# EAGLE design micromouse2018_v1 (EAGLE 8.7.1)
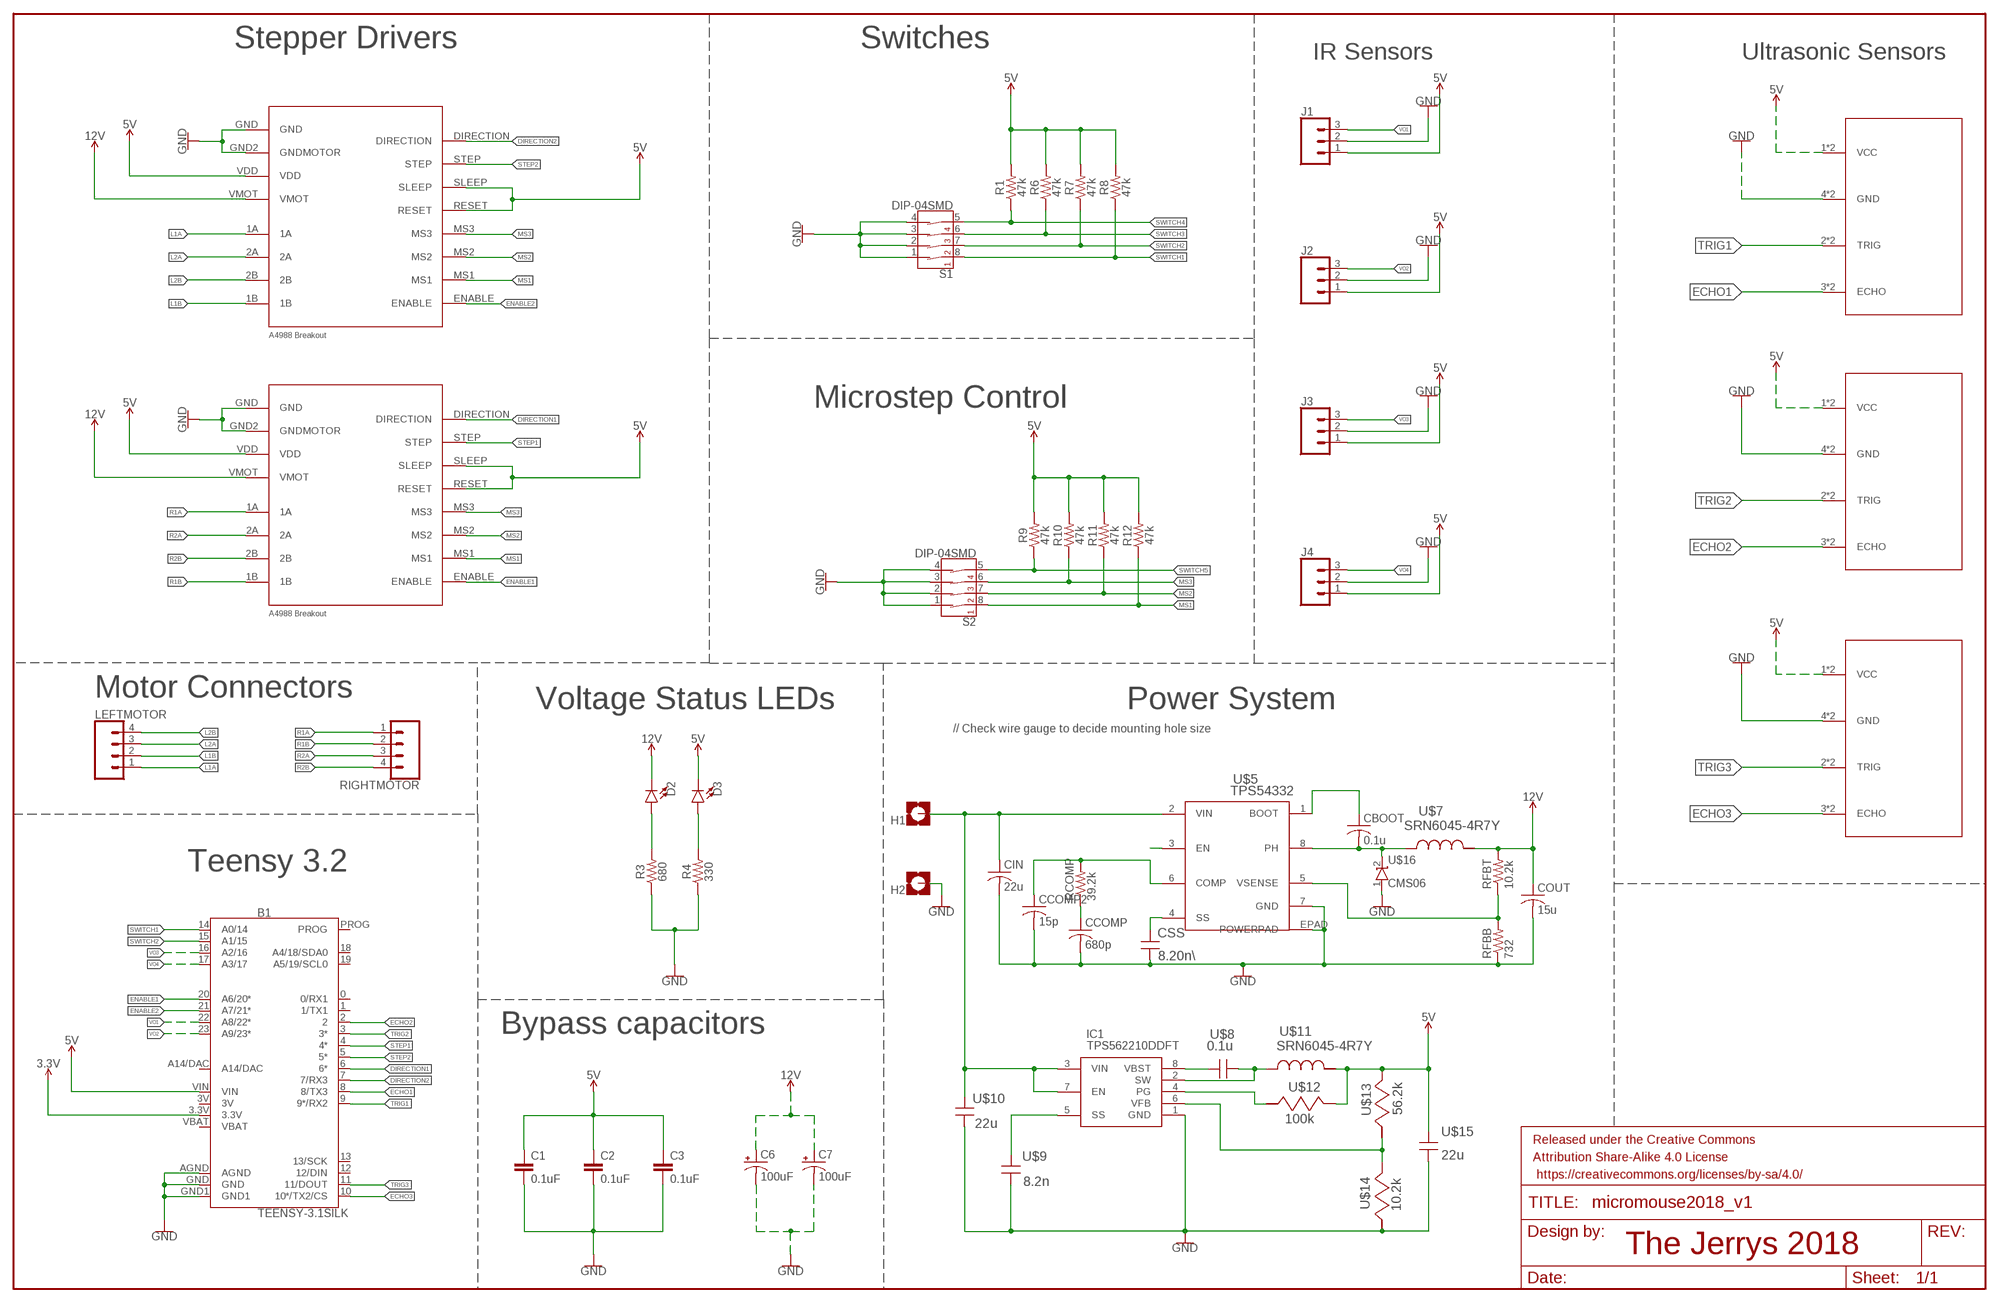
[diagram p0: schematic, sheet 1]

## Parts
B1  TEENSY-3.1SILK  [TEENSY-3.1]
C1  0.1uF  0.1UF-0603-25V-(+80/-20%)  [0603]
C2  0.1uF  0.1UF-0603-25V-(+80/-20%)  [0603]
C3  0.1uF  0.1UF-0603-25V-(+80/-20%)  [0603]
C6  100uF  100UF-POLAR-25V-20%(ELEC)  [PANASONIC_D]
C7  100uF  100UF-POLAR-25V-20%(ELEC)  [PANASONIC_D]
CBOOT  0.1u  C-USC0805  [C0805]
CCOMP  680p  C-USC0805  [C0805]
CCOMP2  15p  C-USC0805  [C0805]
CIN  22u  C-USC1210  [C1210]
COUT  15u  C-USC0805  [C0805]
CSS  8.20n\  12063A822JAT2A  [1206]
D2  LED0603  [LED-0603]
D3  LED0603  [LED-0603]
FRAME1  FRAME-LEDGER  [CREATIVE_COMMONS]
H1  MOUNT-PAD-SQUARE2.8  [2,8-PAD-SQUARE]
H2  MOUNT-PAD-SQUARE2.8  [2,8-PAD-SQUARE]
IC1  TPS562210DDFT  [SOT65P280X110-8N]
J1  CONN_03JST-PTH-VERT  [JST-3-PTH-VERT]
J2  CONN_03JST-PTH-VERT  [JST-3-PTH-VERT]
J3  CONN_03JST-PTH-VERT  [JST-3-PTH-VERT]
J4  CONN_03JST-PTH-VERT  [JST-3-PTH-VERT]
LEFTMOTOR  CONN_04LONGPADS  [1X04_LONGPADS]
R1  47k  47KOHM-0603-1/10W-1%  [0603]
R3  680  680OHM-0603-1/10W-5%  [0603]
R4  330  330OHM-0603-1/10W-1%  [0603]
R6  47k  47KOHM-0603-1/10W-1%  [0603]
R7  47k  47KOHM-0603-1/10W-1%  [0603]
R8  47k  47KOHM-0603-1/10W-1%  [0603]
R9  47k  47KOHM-0603-1/10W-1%  [0603]
R10  47k  47KOHM-0603-1/10W-1%  [0603]
R11  47k  47KOHM-0603-1/10W-1%  [0603]
R12  47k  47KOHM-0603-1/10W-1%  [0603]
RCOMP  39.2k  R-US_R0805  [R0805]
RFBB  732  R-US_R0805  [R0805]
RFBT  10.2k  R-US_R0805  [R0805]
RIGHTMOTOR  CONN_04LONGPADS  [1X04_LONGPADS]
S1  DIP-04SMD  [DIPSWITCH-04-SMD]
S2  DIP-04SMD  [DIPSWITCH-04-SMD]
U$1  A4988_BREAKOUT  [A4988_BREAKOUT]
U$2  A4988_BREAKOUT  [A4988_BREAKOUT]
U$3  ULTRASONIC  [1X04_SMD_VERTICAL_COMBO]
U$4  ULTRASONIC  [1X04_SMD_VERTICAL_COMBO]
U$5  TPS54332  [DDA8_2P13X3-M]
U$6  ULTRASONIC  [1X04_SMD_VERTICAL_COMBO]
U$7  SRN6045-4R7Y  [SRN6045]
U$8  0.1u  08053C104KAT2A  [0805]
U$9  8.2n  12063A822JAT2A  [1206]
U$10  22u  GRM32ER61E226KE15L  [1210]
U$11  SRN6045-4R7Y  [SRN6045]
U$12  100k  RR1220P-104-D  [0805]
U$13  56.2k  ERJ-6ENF5622V  [0805]
U$14  10.2k  ERJ-6ENF1022V  [0805]
U$15  22u  GRM31CR61A226KE19L  [1206_190]
U$16  CMS06  [SODFL4724X108N]

## Nets
3.3V: B1.3.3V
5V: B1.VIN C1.1 C2.1 C3.1 D3.C J1.1 J2.1 J3.1 J4.1 R1.2 R6.2 R7.2 R8.2 R9.2 R10.2 R11.2 R12.2 U$1.RESET U$1.SLEEP U$1.VDD U$2.RESET U$2.SLEEP U$2.VDD U$3.1(VCC) U$3.1-2(VCC) U$4.1(VCC) U$4.1-2(VCC) U$6.1(VCC) U$6.1-2(VCC) U$11.2 U$12.1 U$13.1 U$15.1
12V: C6.+ C7.+ COUT.1 D2.C RFBT.2 U$1.VMOT U$2.VMOT U$7.2
BOOT: IC1.2(SW) U$8.1 U$11.1
DIRECTION1: B1.6(6*) U$2.DIRECTION
DIRECTION2: B1.7(7/RX3) U$1.DIRECTION
ECHO1: B1.8(8/TX3) U$3.3(ECHO) U$3.3-2(ECHO)
ECHO2: B1.2 U$4.3(ECHO) U$4.3-2(ECHO)
ECHO3: B1.10(10*/TX2/CS) U$6.3(ECHO) U$6.3-2(ECHO)
ENABLE1: B1.20(A6/20*) U$2.ENABLE
ENABLE2: B1.21(A7/21*) U$1.ENABLE
GND: B1.AGND B1.GND B1.GND1 C1.2 C2.2 C3.2 C6.- C7.- CCOMP2.2 CCOMP.2 CIN.2 COUT.2 CSS.1 H2.B2,8(MOUNT) IC1.1(GND) J1.2 J2.2 J3.2 J4.2 R3.1 R4.1 RFBB.1 S1.1(1A) S1.2(2A) S1.3(3A) S1.4(4A) S2.1(1A) S2.2(2A) S2.3(3A) S2.4(4A) U$1.GND U$1.GND2(GNDMOTOR) U$2.GND U$2.GND2(GNDMOTOR) U$3.4(GND) U$3.4-2(GND) U$4.4(GND) U$4.4-2(GND) U$5.7(GND) U$5.EPAD(POWERPAD) U$6.4(GND) U$6.4-2(GND) U$9.2 U$10.2 U$14.2 U$15.2 U$16.1(A)
L1A: LEFTMOTOR.1 U$1.1A
L1B: LEFTMOTOR.2 U$1.1B
L2A: LEFTMOTOR.3 U$1.2A
L2B: LEFTMOTOR.4 U$1.2B
MS1: R12.1 S2.8(1B) U$1.MS1 U$2.MS1
MS2: R11.1 S2.7(2B) U$1.MS2 U$2.MS2
MS3: R10.1 S2.6(3B) U$1.MS3 U$2.MS3
N$1: D2.A R3.2
N$2: D3.A R4.2
N$5: CSS.2 U$5.4(SS)
N$6: IC1.8(VBST) U$8.2
N$8: U$5.3(EN)
N$9: RFBB.2 RFBT.1 U$5.5(VSENSE)
N$10: CBOOT.1 U$5.1(BOOT)
N$11: CCOMP2.1 RCOMP.2 U$5.6(COMP)
N$12: CCOMP.1 RCOMP.1
N$15: IC1.4(PG) U$12.2
N$16: IC1.6(VFB) U$13.2 U$14.1
N$18: IC1.5(SS) U$9.1
PH: CBOOT.2 U$5.8(PH) U$7.1 U$16.2(K)
R1A: RIGHTMOTOR.1 U$2.1A
R1B: RIGHTMOTOR.2 U$2.1B
R2A: RIGHTMOTOR.3 U$2.2A
R2B: RIGHTMOTOR.4 U$2.2B
STEP1: B1.4(4*) U$2.STEP
STEP2: B1.5(5*) U$1.STEP
SWITCH1: B1.14(A0/14) R8.1 S1.8(1B)
SWITCH2: B1.15(A1/15) R7.1 S1.7(2B)
SWITCH3: R6.1 S1.6(3B)
SWITCH4: R1.1 S1.5(4B)
SWITCH5: R9.1 S2.5(4B)
TRIG1: B1.9(9*/RX2) U$3.2(TRIG) U$3.2-2(TRIG)
TRIG2: B1.3(3*) U$4.2(TRIG) U$4.2-2(TRIG)
TRIG3: B1.11(11/DOUT) U$6.2(TRIG) U$6.2-2(TRIG)
VIN: CIN.1 H1.B2,8(MOUNT) IC1.3(VIN) IC1.7(EN) U$5.2(VIN) U$10.1
VO1: B1.22(A8/22*) J1.3
VO2: B1.23(A9/23*) J2.3
VO3: B1.16(A2/16) J3.3
VO4: B1.17(A3/17) J4.3
Unconnected: B1.0(0/RX1) B1.1(1/TX1) B1.12(12/DIN) B1.13(13/SCK) B1.18(A4/18/SDA0) B1.19(A5/19/SCL0) B1.A14/DAC B1.PROG

## Notes on the sheet
- Stepper Drivers | Switches
- IR Sensors | Ultrasonic Sensors
- Microstep Control
- Motor Connectors
- Voltage Status LEDs | Power System
- // Check wire gauge to decide mounting hole size
- Teensy 3.2
- Bypass capacitors
- The Jerrys 2018

## Power pins joined to a net without a drawn wire
3V: B1.3V
VBAT: B1.VBAT

## Library data of the parts
B1 = SparkFun-Boards:TEENSY-3.1: Teensy 3+ Footprint Mechanical footprint with connectors for Teensy Development Board with ARM Cortex. SparkFun Products: Teensy 3.2 <https://www.sparkfun.com/products/13736> Teensy LC <https://www.sparkfun.com/products/13305>; SF_ID: DEV-12646
C1-C3 = SparkFun-Capacitors:0.1UF: 0.1µF ceramic capacitors A capacitor is a passive two-terminal electrical component used to store electrical energy temporarily in an electric field.; PROD_ID: CAP-00810
C6 C7 = SparkFun-Capacitors:100UF-POLAR: 100µF polarized capacitors A capacitor is a passive two-terminal electrical component used to store electrical energy temporarily in an electric field.; PROD_ID: CAP-12547
CBOOT CCOMP CCOMP2 COUT = resistor:C-US: CAPACITOR, American symbol
CIN = rcl:C-US: CAPACITOR, American symbol
CSS U$9 = AcceleratedDesigns_Lib:12063A822JAT2A; CAP: 8.2E8; DATASHEETURL: httpwww.avx.comdocsCatalogsccog.pdf; ESR: 0.0; IRMS: 0.0; MANUFACTURER_NAME: AVX; MANUFACTURER_PART_NUMBER: 12063A822JAT2A; VDC: 25.0; VENDOR: AVX
D2 D3 = SparkFun-LED:LED: LED (Generic) Standard schematic elements and footprints for 5mm, 3mm, 1206, and 0603 sized LEDs. Generic LEDs with no color specified.
FRAME1 = SparkFun-Aesthetics:FRAME-LEDGER: Schematic Frame - Ledger Standard 11x14 US Ledger frame
H1 H2 = holes:MOUNT-PAD-SQUARE: MOUNTING PAD, square
IC1 = TPS562210DDFT:TPS562210DDFT: Step-down DC-DC Conv 4.5-17V 2A TSOT23-8 Texas Instruments, TPS562210DDFT Step-Down Switching Regulator 2A Adjustable, 0.76 7 V, 8-Pin SOT-23 Source: Datasheet <http://www.ti.com/lit/ds/symlink/tps562210.pdf>; DESCRIPTION: Step-down DC-DC Conv 4.5-17V 2A TSOT23-8 Texas Instruments, TPS562210DDFT Step-Down Switching Regulator 2A Adjustable, 0.76 7 V, 8-Pin SOT-23; HEIGHT: 1.1mm; MANUFACTURER_NAME: Texas Instruments; MANUFACTURER_PART_NUMBER: TPS562210DDFT; RS_PART_NUMBER: 9009845; RS_PRICE/STOCK: http://uk.rs-online.com/web/p/products/9009845
J1-J4 = SparkFun-Connectors:CONN_03: Multi connection point. Often used as Generic Header-pin footprint for 0.1 inch spaced/style header connections On any of the 0.1 inch spaced packages, you can populate with these: Break Away Headers - Straight <https://www.sparkfun.com/products/116> (PRT-00116) Break Away Male Headers - Right Angle <https://www.sparkfun.com/products/553> (PRT-00553) Female Headers <https://www.sparkfun.com/products/115> (PRT-00115) Break Away Headers - Machine Pin <https://www.sparkfun.com/products/117> (PRT-00117) Break Away Female Headers - Swiss Machine Pin <https://www.sparkfun.com/products/743> (PRT-00743) Stackable Header - 3 Pin (Female, 0.1") <https://www.sparkfun.com/products/13875> (PRT-13875) For SCREWTERMINALS and SPRING TERMINALS visit here: Screw Terimnals on SparkFun.com <https://www.sparkfun.com/search/results?term=Screw+Terminals> (5mm/3.5mm/2.54mm spacing) This device is also useful as a general connection point to wire up your design to another part of your project. Our various solder wires solder well into these plated through hole pads. Hook-Up Wire - Assortment (Stranded, 22 AWG) <https://www.sparkfun.com/products/11375> (PRT-11375) Hook-Up Wire - Assortment (Solid Core, 22 AWG) <https://www.sparkfun.com/products/11367> (PRT-11367) View the entire wire category on our website here <https://www.sparkfun.com/categories/141> Special notes: Molex polarized connector foot print use with SKU : PRT-08232 with associated crimp pins and housings.; PROD_ID: CONN-13230
LEFTMOTOR RIGHTMOTOR = SparkFun-Connectors:CONN_04: Multi connection point. Often used as Generic Header-pin footprint for 0.1 inch spaced/style header connections On any of the 0.1 inch spaced packages, you can populate with these: Break Away Headers - Straight <https://www.sparkfun.com/products/116> (PRT-00116) Break Away Male Headers - Right Angle <https://www.sparkfun.com/products/553> (PRT-00553) Female Headers <https://www.sparkfun.com/products/115> (PRT-00115) Break Away Headers - Machine Pin <https://www.sparkfun.com/products/117> (PRT-00117) Break Away Female Headers - Swiss Machine Pin <https://www.sparkfun.com/products/743> (PRT-00743) For SCREWTERMINALS and SPRING TERMINALS visit here: Screw Terimnals on SparkFun.com <https://www.sparkfun.com/search/results?term=Screw+Terminals> (5mm/3.5mm/2.54mm spacing) This device is also useful as a general connection point to wire up your design to another part of your project. Our various solder wires solder well into these plated through hole pads. Hook-Up Wire - Assortment (Stranded, 22 AWG) <https://www.sparkfun.com/products/11375> (PRT-11375) Hook-Up Wire - Assortment (Solid Core, 22 AWG) <https://www.sparkfun.com/products/11367> (PRT-11367) View the entire wire category on our website here <https://www.sparkfun.com/categories/141> Special notes: Molex polarized connector foot print use with SKU : PRT-08231 with associated crimp pins and housings. 1MM SMD Version SKU: PRT-10208; PROD_ID: CONN-09696
R1 R6-R12 = SparkFun-Resistors:47KOHM: 47kΩ resistor A resistor is a passive two-terminal electrical component that implements electrical resistance as a circuit element. Resistors act to reduce current flow, and, at the same time, act to lower voltage levels within circuits. - Wikipedia; PROD_ID: RES-07871
R3 = SparkFun-Resistors:680OHM: 680Ω resistor A resistor is a passive two-terminal electrical component that implements electrical resistance as a circuit element. Resistors act to reduce current flow, and, at the same time, act to lower voltage levels within circuits. - Wikipedia; PROD_ID: RES-09333
R4 = SparkFun-Resistors:330OHM: 330Ω resistor A resistor is a passive two-terminal electrical component that implements electrical resistance as a circuit element. Resistors act to reduce current flow, and, at the same time, act to lower voltage levels within circuits. - Wikipedia; PROD_ID: RES-00818
RCOMP RFBB RFBT = resistor:R-US_: RESISTOR, American symbol
S1 S2 = SparkFun-Switches:DIP-04: 4-Position DIP Switch 4-circuit DIP (dual inline package) switch. Commonly used to physcially set a circuit's behavior. SparkFun Products Prototype Part; PROD_ID: SWCH-12418
U$1 U$2 = raParts:A4988_BREAKOUT
U$3 U$4 U$6 = raParts:ULTRASONIC
U$5 = TPS54332:TPS54332
U$7 U$11 = AcceleratedDesigns_Lib:SRN6045-4R7Y; DATASHEETURL: httpwww.bourns.comdataglobalpdfsSRN6045.pdf; DCR: 0.0376; IDC: 3.0; L: 4.7E6; MANUFACTURER_NAME: Bourns; MANUFACTURER_PART_NUMBER: SRN60454R7Y; VENDOR: Bourns
U$8 = AcceleratedDesigns_Lib:08053C104KAT2A; CAP: 1.0E7; ESR: 0.28; IRMS: 0.0; MANUFACTURER_NAME: AVX; MANUFACTURER_PART_NUMBER: 08053C104KAT2A; VDC: 25.0; VENDOR: AVX
U$10 = AcceleratedDesigns_Lib:GRM32ER61E226KE15L; CAP: 2.2E5; ESR: 0.0020; IRMS: 0.0; MANUFACTURER_NAME: MuRata; MANUFACTURER_PART_NUMBER: GRM32ER61E226KE15L; VDC: 25.0; VENDOR: MuRata
U$12 = AcceleratedDesigns_Lib:RR1220P-104-D; MANUFACTURER_NAME: Susumu Co Ltd; MANUFACTURER_PART_NUMBER: RR1220P104D; POWER: 0.1; RESISTANCE: 100000.0; TOLERANCE: 0.5; VENDOR: Susumu Co Ltd
U$13 = AcceleratedDesigns_Lib:ERJ-6ENF5622V; MANUFACTURER_NAME: Panasonic; MANUFACTURER_PART_NUMBER: ERJ6ENF5622V; POWER: 0.125; RESISTANCE: 56200.0; TOLERANCE: 1.0; VENDOR: Panasonic
U$14 = AcceleratedDesigns_Lib:ERJ-6ENF1022V; MANUFACTURER_NAME: Panasonic; MANUFACTURER_PART_NUMBER: ERJ6ENF1022V; POWER: 0.125; RESISTANCE: 10200.0; TOLERANCE: 1.0; VENDOR: Panasonic
U$15 = AcceleratedDesigns_Lib:GRM31CR61A226KE19L; CAP: 2.2E5; ESR: 0.0; IRMS: 0.0; MANUFACTURER_NAME: MuRata; MANUFACTURER_PART_NUMBER: GRM31CR61A226KE19L; VDC: 10.0; VENDOR: MuRata
U$16 = Scraps:CMS06

## Board
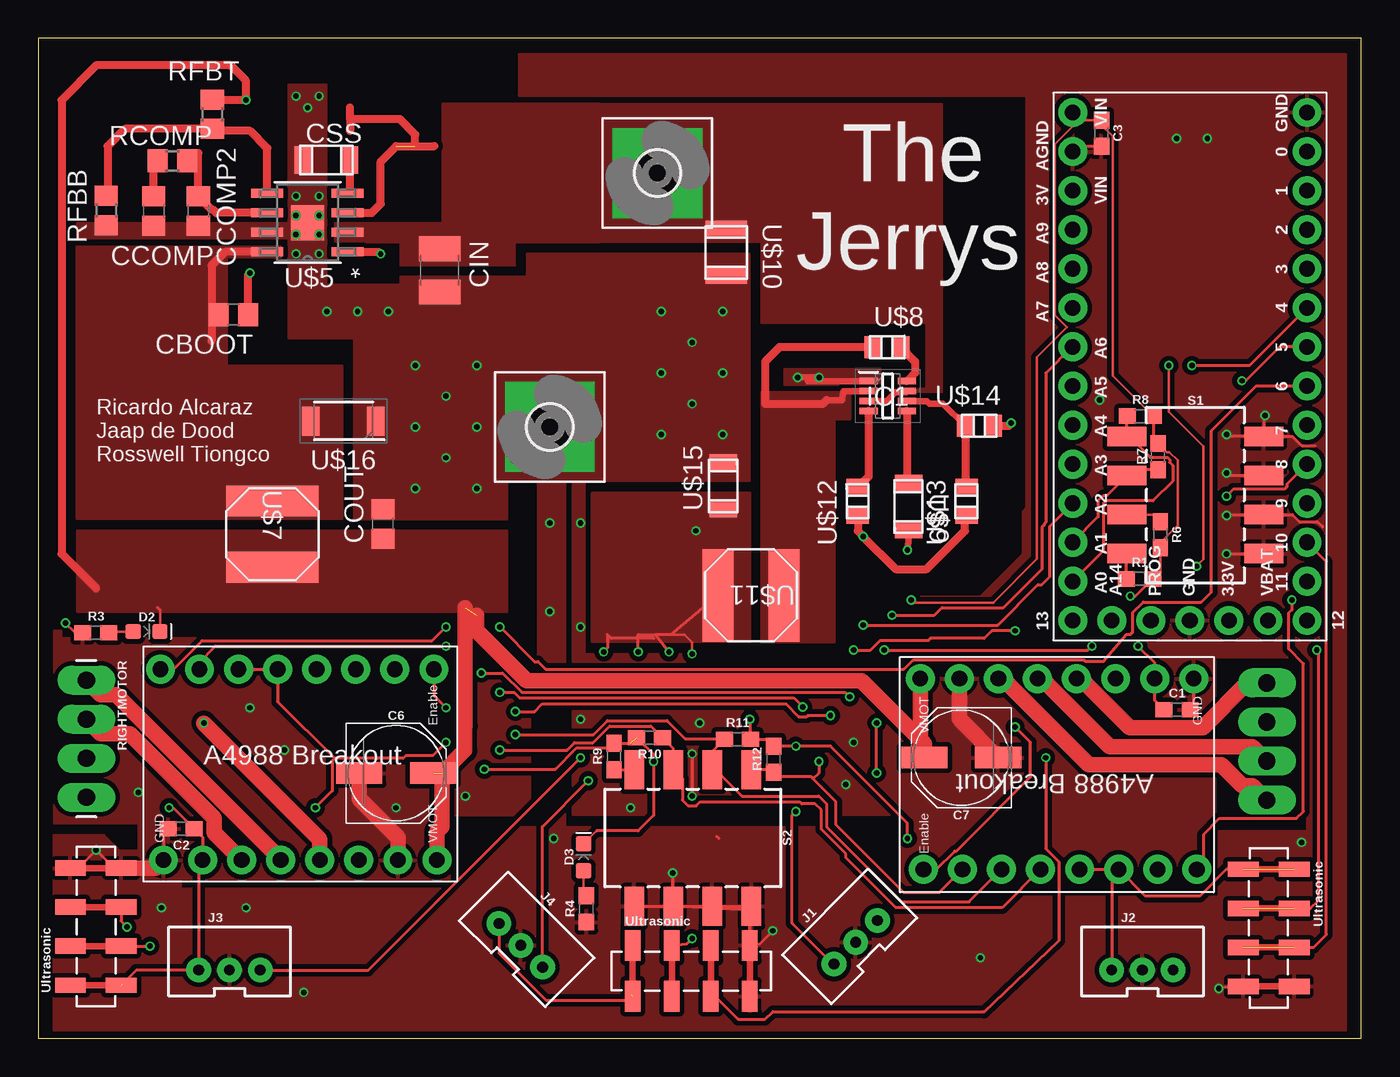
[diagram p1: board, top side]
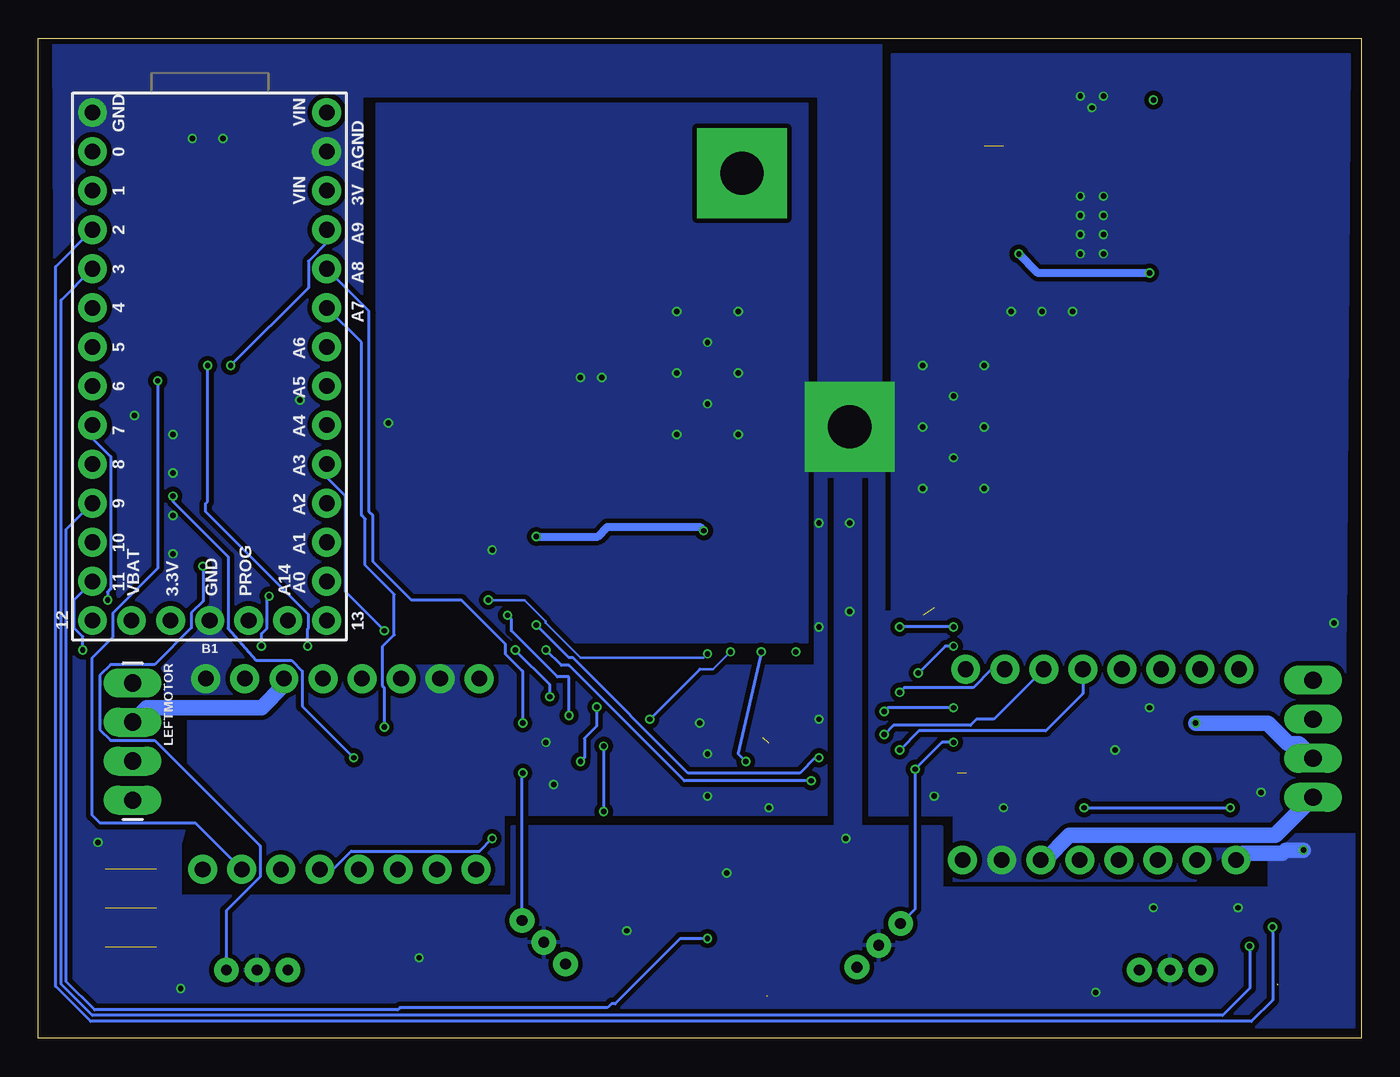
[diagram p2: board, bottom side, seen from below]

Size 86 x 65 mm. Coordinates in mm from the lower left corner, seen from the top.
Outline: 0,0 86,0 86,65 0,65 0,0
Copper layers (1*16): Top 0.035559375mm / dielectric 1.6mm / Bottom 0.035559375mm
Design rules "oshpark-2layer": minimum track width 6mil, minimum drill 10mil, track to track 6mil, track to pad 6mil, pad to pad 6mil, via to via 6mil, smd to smd 6mil, copper to edge 15mil, drill to drill 6mil, minimum pad ring 5mil, minimum via ring 5mil, stop-mask expansion 2.5mil, vias tented up to drill 0mil, thermal gap 10mil

### Footprints (pad centres in the part's own frame; a part is rotated, then mirrored left to right if it is on the bottom)
TEENSY-3.1 = drill 1.016 pad 1.88: 0 7.62,-13.97; 1 7.62,-11.43; 2 7.62,-8.89; 3 7.62,-6.35; 3.3V 2.54,16.51; 3V -7.62,-11.43; 4 7.62,-3.81; 5 7.62,-1.27; 6 7.62,1.27; 7 7.62,3.81; 8 7.62,6.35; 9 7.62,8.89; 10 7.62,11.43; 11 7.62,13.97; 12 7.62,16.51; 13 -7.62,16.51; 14 -7.62,13.97; 15 -7.62,11.43; 16 -7.62,8.89; 17 -7.62,6.35; 18 -7.62,3.81; 19 -7.62,1.27; 20 -7.62,-1.27; 21 -7.62,-3.81; 22 -7.62,-6.35; 23 -7.62,-8.89; A14/DAC -5.08,16.51; AGND -7.62,-13.97; GND 0,16.51; GND1 7.62,-16.51; PROG -2.54,16.51; VBAT 5.08,16.51; VIN -7.62,-16.51
0603 = smd 1.1 x 1: 1 -0.85,0; 2 0.85,0
PANASONIC_D = smd 3 x 1.4: + 2.4,0; - -2.4,0
C0805 = smd 1.3 x 1.5: 1 -0.95,0; 2 0.95,0
C1210 = smd 1.6 x 2.7: 1 -1.4,0; 2 1.4,0
1206 = smd 1.118 x 1.803: 1 -1.499,0; 2 1.499,0
LED-0603 = smd 1 x 1: A -0.877,0; C 0.877,0
2,8-PAD-SQUARE = drill 2.8 pad 5.842 square: B2,8 0,0
SOT65P280X110-8N = smd 1.2 x 0.45: 1 -1.25,0.975; 2 -1.25,0.325; 3 -1.25,-0.325; 4 -1.25,-0.975; 5 1.25,-0.975; 6 1.25,-0.325; 7 1.25,0.325; 8 1.25,0.975
JST-3-PTH-VERT = drill 0.7 pad 1.6: 1 -2,-0.55; 2 0,-0.55; 3 2,-0.55
1X04_LONGPADS = drill 1.118 pad 1.88 long: 1 0,0; 2 2.54,0; 3 5.08,0; 4 7.62,0
R0805 = smd 1.3 x 1.5: 1 -0.95,0; 2 0.95,0
DIPSWITCH-04-SMD = smd 1.27 x 2.54: 1 -3.81,4.445; 2 -1.27,4.445; 3 1.27,4.445; 4 3.81,4.445; 5 3.81,-4.445; 6 1.27,-4.445; 7 -1.27,-4.445; 8 -3.81,-4.445
A4988_BREAKOUT = drill 1.016 pad 1.88: 1A 1.41,11.48; 1B 1.41,14.02; 2A 1.41,8.94; 2B 1.41,6.4; DIRECTION 13.81,19.3; ENABLE 13.81,1.52; GND 1.41,19.1; GND2 1.41,3.86; MS1 13.81,4.06; MS2 13.81,6.6; MS3 13.81,9.14; RESET 13.81,11.68; SLEEP 13.81,14.22; STEP 13.81,16.76; VDD 1.41,16.56; VMOT 1.41,1.32
1X04_SMD_VERTICAL_COMBO = smd 1 x 2: 1 0,-1.65; 1-2 0,1.65; 2 2.54,1.65; 2-2 2.54,-1.65; 3 5.08,-1.65; 3-2 5.08,1.65; 4 7.62,1.65; 4-2 7.62,-1.65
DDA8_2P13X3-M = smd 2.083 x 0.584: 1 -2.616,1.905; 2 -2.616,0.635; 3 -2.616,-0.635; 4 -2.616,-1.905; 5 2.616,-1.905; 6 2.616,-0.635; 7 2.616,0.635; 8 2.616,1.905 | smd 2.134 x 2.286: EPAD 0,0
SRN6045 = smd 2 x 6: 1 -2.15,0; 2 2.15,0
0805 = smd 1.118 x 1.448: 1 -0.902,0; 2 0.902,0
1210 = smd 1.118 x 2.692: 1 -1.499,0; 2 1.499,0
1206_190 = smd 1.118 x 1.803: 1 -1.499,0; 2 1.499,0
SODFL4724X108N = smd 1.14 x 1.89: 1 -2.1,0; 2 2.1,0

### Placement (x,y rotation side)
B1  74.87,43.68 180 bottom
C1  74.03,21.37 0 top
C2  9.28,13.63 180 top
C3  69.12,58.84 270 top
C6  23.25,17.25 0 top
C7  60,18.25 180 top
CBOOT  12.68,47.05 180 top
CCOMP  7.5,53.79 270 top
CCOMP2  10.4,53.79 270 top
CIN  26.09,49.93 270 top
COUT  22.4,33.45 90 top
CSS  18.73,57.1 0 top
D2  7.03,26.45 0 top
D3  35.45,11.78 90 top
FRAME1  101.24,73.34 0 top  (outside the outline)
H1  40.25,56.25 0 top
H2  33.25,39.75 0 top
IC1  55.22,41.76 0 top
J1  52.75,6.64 45 top
J2  71.78,5 0 top
J3  12.42,5 0 top
J4  31.75,6.44 315 top
LEFTMOTOR  79.88,23.11 270 bottom
R1  71.6,29.87 0 top
R3  3.73,26.37 0 top
R4  35.63,8.42 90 top
R6  72.95,32.74 270 top
R7  72.8,37.83 90 top
R8  71.64,40.45 0 top
R9  37.42,18.33 90 top
R10  39.73,19.55 180 top
R11  45.46,19.45 0 top
R12  47.8,18.15 90 top
RCOMP  8.71,57.05 0 top
RFBB  4.41,53.82 90 top
RFBT  11.31,60.07 90 top
RIGHTMOTOR  3.12,23.29 270 top
S1  75.22,35.32 270 top
S2  42.54,13.03 180 top
U$1  56.02,24.8 270 top
U$2  27.23,10.19 90 top
U$3  38.64,4.39 0 top
U$4  3.73,3.46 90 top
U$5  17.5,53.03 180 top
U$6  80,11 270 top
U$7  15.21,32.78 270 top
U$8  55.18,44.93 0 top
U$9  56.58,34.57 270 top
U$10  44.72,51.1 270 top
U$11  46.33,28.8 180 top
U$12  53.27,34.92 90 top
U$13  60.35,34.92 90 top
U$14  61.17,39.82 0 top
U$15  44.53,35.92 90 top
U$16  19.83,40.13 180 top

### Tracks (layer width: path | path; a pad name or v marks a point on that pad's centre or on a via)
5V  (via drill 0.35)  (4 unrouted)
  Top 0.152: R7.2 73.37,38.11 73.54,38.11 74.08,37.57 74.08,33.34 72.95,32.22 R6.2 72.95,30.37 R1.2 | v56.75,28.5 56.92,28.33 62.08,28.33 64.92,31.17 64.92,44.27 66.87,46.22 66.08,47.01 66.08,58.13 67.25,59.3 B1.VIN 67.75,59.69 C3.1 69.12,59.36 69.85,58.63 69.85,43.09 72.34,40.59 | v42.5,25 42.5,25.75 42,26.25 41.13,26.25 | 36.29,13.5 D3.C
  Top 0.2: 5.46,3.54 6.37,4.45 J3.1 10.42,11.35 U$2.VDD 10.67,13.09 C2.1 8.76,15 v8.5,15 | U$11.2 41.13,26.25 40.13,26.25 | 40.13,26.25 39,26.25 v39,25.13 | U$2.SLEEP U$2.RESET 15.55,21.9 19.25,18.2 | 19.25,18.2 23.7,18.2 23.9,18.4 25.65,18.4 v26.5,19.25 | C1.1 72.58,21.97 U$1.VDD | U$1.RESET U$1.SLEEP | U$1.SLEEP 69.78,10.53 J2.1 | B1.VIN 67.25,59.5 | 72.34,40.59 R8.2 72.49,38.98 R7.2 | 19.25,18.2 19.1,18.05 19.1,16.1 v18,15 | U$6.1 77.25,11 75.5,9.25 71.98,9.25 U$1.SLEEP | 37.5,19.18 R9.2 37.35,19.25 | 37.5,19.18 38.51,19.18 | 40.13,26.25 v41,25.13 | J1.1 51.66,4.84 49,7.5 49,14.5 v49.25,14.75 | J4.1 29.95,5.55 33,2.5 38.27,2.5 38.56,2.79 | R10.2 39.43,19 39.47,19 40,18.47 v40,18 40,14.5 39,13.5 36.29,13.5 | v46.25,20.75 46.25,19.51 R11.2 47.35,19.45 R12.2 v49.25,19 51.5,19 56.5,14 v56.5,13 | v29,17.5 33.61,17.5 34.99,18.88 37.2,18.88 37.5,19.18 | 40,26 37.25,26 37,26.25 37,25.38 v36.75,25.13 | U$1.VDD 72.58,23.83 | U$1.VDD 72.58,24.42 v71.5,25.5 | v71,28.75 71.33,28.75 R1.2
  Top 0.305: U$4.1-2 U$4.1 | U$3.1-2 U$3.1
  Top 0.508: 53.25,34 U$12.1 53.27,32.98 v53.62,32.62 55.75,30.5 57.75,30.5 60.25,33 60.25,33.92 U$13.1
  Bottom 0.152: v56.75,28.5 54.39,28.5 53.02,27.13 53.02,27.02 50.75,24.75 42.75,24.75 v42.5,25 | 43,24 42.13,24 v41,25.13
  Bottom 0.2: v18,15 v8.5,15 | v49.25,19 v49.25,14.75 | J4.1 29,8.41 v29,17.5 27.25,19.25 v26.5,19.25 | v39,25.13 40.5,18.5 v40,18 | v46.25,20.75 43,24 | v56.5,13 57.32,12.18 65.65,12.18 66.85,10.99 U$1.RESET | v71.5,25.5 71.5,26.31 71.14,26.68 71.14,28.61 v71,28.75
  Bottom 0.508: v53.62,32.62 49.62,32.62 49,33.25 43,33.25 v42.75,33
  pour Top (isolate 0.305, no thermals): 36,35.5 46.25,35.5 46.25,25.75 36,25.75
12V  (via drill 0.35)  (2 unrouted)
  Top 0.152: D2.C 7.91,27.84 7.75,28
  Top 0.2: 7.75,28 7.91,27.84
  Top 0.508: 3.75,29.25 1.5,31.5 1.5,61 3.75,63.25 12.5,63.25 13.5,62.25 v13.5,61 13.48,61.02 RFBT.2
  Top 1.016: U$2.VMOT 25.91,13.47 26.25,13.81 26.25,17.25 27.72,18.72 27.72,20.27 27.75,20.3 27.75,28 | 57.2,23.25 U$1.VMOT 57.34,18.51 C7.+ 57.6,19.15 53.5,23.25 31.75,23.25 28.5,26.5 28.5,27.5
  pour Top (isolate 0.305, no thermals): 30.5,33 2.5,33 2.5,27.75 30.5,27.75
BOOT
  Top 0.406: IC1.2 52.34,42.09 52.25,41.5 51.25,41.5
  Top 0.508: U$8.1 48.18,44.93 47.25,44 47.25,41.25 51,41.25 51.25,41.5
  pour Top (isolate 0.305, no thermals): 52.75,42 47,42 47,25.75 51.75,25.75 51.75,40.25 52.75,40.25
DIRECTION1  (via drill 0.35)
  Top 0.2: v26.5,26.75 25.6,25.85 10.64,25.85 8.78,24 U$2.DIRECTION | B1.6 79.16,42.41 76.25,39.5 76.25,29 75.61,28.36 71.84,28.36 71.14,27.66 71.14,26.39 71,26.25 70.75,26.25 69.25,24.5 68.08,24.5 67.99,24.58 56.85,24.58 | 56.85,24.58 56.76,24.5 | v30,26.75 32.25,24.5 32.5,24.5 32.99,24.01 56.27,24.01 56.85,24.58
  Bottom 0.2: v26.5,26.75 v30,26.75
DIRECTION2  (via drill 0.35)
  Top 0.2: v81.5,28.5 81.5,27.87 81.3,27.66 81.3,25.32 82.25,24.37 82.25,14.75 81.8,14.3 76.8,14.3 75.75,13.25 75.75,11.42 U$1.DIRECTION
  Bottom 0.2: B1.7 82.49,39.02 81.3,37.82 81.3,29.22 81.5,29.01 v81.5,28.5
ECHO1  (via drill 0.35)
  Top 0.2: B1.8 81.19,36.03 81.19,35.85 81.04,35.7 77.7,35.7 v77.25,35.25 | v65.5,18.25 65.5,12.34 66.35,11.48 66.35,6.35 61.47,1.72 61.44,1.75 47.75,1.75 47.25,1.25 45.5,1.25 44.01,2.75 U$3.3
  Top 0.305: U$3.3-2 U$3.3
  Bottom 0.2: v77.25,35.25 77.25,34.89 73.68,31.32 73.68,26.68 71.83,24.58 69.55,24.58 68.85,23.88 68.85,21.6 v65.5,18.25
ECHO2  (via drill 0.35)
  Top 0.2: U$4.3 5.38,7.62 v5.75,7.25
  Top 0.305: U$4.3-2 U$4.3
  Bottom 0.2: v5.75,7.25 5.75,2.5 7.13,1.12 82.62,1.12 84.88,3.38 84.88,50.18 B1.2
ECHO3  (1 unrouted)
  Top 0.2: U$6.3-2 82.92,5.92 83.75,6.75 83.75,30.99 B1.10
ENABLE1  (via drill 0.35)
  Top 0.2: U$2.ENABLE 25.71,22.29 v26.5,21.5 | v51.5,21 50.03,21 49.96,20.92 49.44,20.92 48.61,21.75 32.75,21.75 32.25,21.25 v31,21.25 | B1.20 67.2,44.95 65.5,43.25 65.5,33.54 65.4,33.44 65.4,33.4 65.25,33.25 65.25,30.5 62.75,28 58.75,28 58.26,27.51 v55.5,27.51
  Bottom 0.2: v26.5,21.5 30.75,21.5 v31,21.25 | v51.5,21 51.5,23.5 52.25,23.5 55.25,26.5 55.25,27.26 v55.5,27.51
ENABLE2  (via drill 0.35)
  Top 0.2: U$1.ENABLE 58.39,10.99 59.59,12.18 59.68,12.18 64.5,17 64.5,19.25 v63.5,20.25
  Bottom 0.2: v63.5,20.25 63.5,22.78 63.61,22.9 63.61,25.5 62.87,26.24 62.87,28.87 64.75,30.75 64.75,33.75 65,34 65,45.24 B1.21
GND  (via drill 0.35)
  Top 0.152: C3.2 67.59,57.99 B1.AGND
  Top 0.2: U$4.4 2.58,11.08 v3.75,12.25 4.92,11.08 U$4.4-2 | C2.2 8.13,13.33 U$2.GND | C1.2 75.12,21.61 U$1.GND | S1.1 79.67,40.41 v79.75,40.5 | S2.4 S2.3 | S2.3 S2.2 S2.1 | 46.25,8.32 46.26,8.32 | 46.25,8.32 S2.3 | U$6.4 U$6.4-2 78.13,3.38 v76.75,3.25 | S1.1 77.62,39.13 v77.25,39.25 | S1.2 77.41,36.59 v77.25,36.75 | v77.25,34 77.3,34.05 S1.3 81.54,34.05 82,33.6 83.15,33.6 83.5,33.25 | S1.4 v77.26,31.51 v77.25,31.5 | S2.3 41.27,10.73 v41.25,10.75 | 46.25,8.32 46.26,8.32 U$3.4 46.92,6.17 v47.75,7 | R3.1 2.38,26.37 v1.75,27 | 44.12,13.13 44.25,13 | S1.1 81.54,39.13 82.15,38.52 82.98,38.52 83,38.5 | v42.5,15.75 v42.5,18.5 42.5,18.75
  Top 0.305: U$4.4 U$4.4-2 | U$3.4-2 U$3.4
  Top 0.406: U$9.2 56.58,32.33 v56.5,31.75 | IC1.1 50.02,42.73 v50.76,42.97 v49.37,42.97
  Top 0.508: U$14.2 63.07,39.82 v63.25,40
  Top 1.016: U$2.GND2 23.37,13.05 20.85,15.57 C6.- | C7.- 59.88,20.77 U$1.GND2 | U$2.GND 7.61,11.08 5.86,11.08
  Bottom 1.016: U$2.GND 7.7,12.03 5.11,12.03 4.89,12.25 v3.75,12.25
  other vias: 28.5,35.75 26.5,37.75 28.5,39.75 24.5,39.75 22.75,47.25 20.75,47.25 18.75,47.25 24.5,35.75 26.5,41.75 28.5,43.75 24.5,43.75 16.75,54.75 18.25,54.75 16.75,53.5 18.25,53.5 16.75,52.25 18.25,52.25 16.75,51 18.25,51 16.75,61.25 18.25,61.25 17.5,60.5 33.5,13 44.5,39.25 42.5,41.25 44.5,43.25 40.5,43.25 40.5,39.25 42.5,45.25 44.5,47.25 40.5,47.25 13.75,21.5 16,18.75 6.5,16 27.75,15.75 23.25,15 8,8.5 13.5,8.5 17.25,3 33.25,33.5 33.25,27.75 61.25,5.25 82.12,12.75 69,41.5 74,58.5 76,58.5 38.5,15 43,20.5 35.25,20.75 35.25,26.75 35.25,33.5 53,19.25 52.5,16.5
  pour Top (isolate 0.254, no thermals): 54.75,42.5 48.5,42.5 48.5,43.5 54.75,43.5
  pour Bottom (isolate 0.305, rank 5, no thermals): 36,60.75 36,25.75 64,25.75 64,60.75
  pour Top (isolate 0.305, no thermals): 18.75,52 18.75,53 2.5,53 2.5,52
  pour Bottom (isolate 0.305, no thermals): 30.5,64 0.75,64 1,26.5 30.5,26.5
  pour Top (isolate 0.305, no thermals): 20.5,33.75 30.5,33.75 30.5,36.25 46.25,36.25 46.25,51 31.75,51 31.75,49.5 23.5,49.5 23.5,49 18.75,49 18.75,62 16.25,62 16.25,45.5 20.5,45.5
  pour Bottom (isolate 0.305): 0,13.25 6,13.25 6,9.75 27.25,9.75 27.25,13.75 55.25,13.75 55.25,9.25 76.75,9.25 76.75,13.5 85,13.5 84.75,0.5 0,0.75
  pour Bottom (isolate 0.305, no thermals): 73.5,24.75 76.75,12.75 84.75,12.75 85,65 31.25,65 31.25,36.5 35.25,36.5 35.25,61.25 65,61.25 65,25
  pour Bottom (isolate 0.305, no thermals): 1,14 1,27.75 31,27.75 31,40.75 32,40.75 32,14.5 26.5,14.5 26.5,10.25 10.75,10.25 6.75,14
  pour Bottom (isolate 0.305, no thermals): 32.5,12.75 32.5,40.75 34.25,40.75 34.25,12.75
  pour Bottom (isolate 0.305, no thermals): 34.75,40.75 34.75,14.5 55.75,14.5 55.75,10 76.25,10 76.25,24.25 35.5,24.25 35.5,40.75
  pour Top (isolate 0.305): 1,26.5 1,14 6.5,14 6.5,10.25 26.75,10.25 26.75,14.5 32,14.5 32,38.25 31,38.25 31,26 1.5,26 1.5,26.5
  pour Top (isolate 0.305): 1,13.25 4.25,13.25 5.25,12.25 9.25,12.25 9.25,10 9.25,9.75 27.25,9.75 27.25,13.75 32.5,13.75 32.5,37.75 34.25,37.75 34.25,13.75 54,13.75 55.25,13.75 55.25,9.25 76.75,9.25 76.75,13.5 82.5,13.5 82.5,24.75 56.5,24.75 56.5,28.75 61.25,28.75 64,31.5 64,34.25 64.25,34.5 64.25,61.25 31.25,61.25 31.25,64 85,64 85,0.5 1,0.5
  pour Top (isolate 0.305): 34.75,14.5 34.75,40.75 35.5,40.75 35.5,25 55.25,25 55.75,24.75 76.5,24.75 76.5,9.5 56,9.5 56,14.5
L1A
  Top 1.016: U$1.1A 67.78,23.39 70.96,20.21 75.7,20.21 78.6,23.11 LEFTMOTOR.1
L1B
  Bottom 1.016: U$1.1B 70.04,22.96 71.5,21.5 78.95,21.5 LEFTMOTOR.2
L2A
  Top 1.016: U$1.2A 65.24,23.39 69.66,18.97 78.94,18.97 LEFTMOTOR.3
L2B
  Top 1.016: U$1.2B 62.7,23.39 68.29,17.8 76.91,17.8 78.28,16.43 78.94,16.43 LEFTMOTOR.4
MS1  (via drill 0.35)
  Top 0.2: U$1.MS1 58.59,9.5 56.25,9.5 51.85,13.9 51.85,15.4 50.38,16.88 | S2.8 47.62,17.48 R12.1 48.1,17 50.25,17 50.38,16.88 | v30,22.5 30.93,22.5 31.29,22.14 49.11,22.14 v49.7,21.55 | v50.75,18 50.75,17.25 50.38,16.88
  Bottom 0.2: U$2.MS1 24.02,24 25.22,22.81 29.69,22.81 v30,22.5 | v49.7,21.55 49.7,20.3 50.5,19.5 50.5,18.25 v50.75,18
MS2  (via drill 0.35)
  Top 0.2: U$1.MS2 60.5,8.87 56.12,8.87 51.25,13.75 51.25,15.25 50.75,15.75 45.75,15.75 44.02,17.48 S2.7 43.81,18.65 R11.1 42.09,19.45 40.88,20.66 36.99,20.66 36.09,19.75 v31,19.75
  Bottom 0.2: U$2.MS2 23.88,20.75 25,20.75 25.4,20.35 30.4,20.35 v31,19.75
MS3  (via drill 0.35)
  Top 0.2: U$1.MS3 62.67,8.5 55.75,8.5 52.5,11.75 52.5,12 50.9,13.6 50.9,14.85 50.5,15.25 49.64,15.25 49.51,15.38 43.02,15.38 42.76,15.12 42.24,15.12 41.87,15.49 41.87,16.88 S2.6 41.27,18.86 R10.1 39.83,20.3 37.14,20.3 36.07,19.23 34.84,19.23 34.36,18.75 v30,18.75
  Bottom 0.2: 18.94,24 U$2.MS3 18.09,22.41 20.5,20 28.75,20 v30,18.75
N$1
  Top 0.152: D2.A 4.66,26.45 R3.2
N$2
  Top 0.152: D3.A 35.45,9.45 R4.2
N$5
  Top 0.508: CSS.2 20.23,55.05 U$5.4
N$6
  Top 0.508: U$8.2 56.08,44.92 57,44 57,43.27 IC1.8
N$8  (1 unrouted)
  Top 0.508: U$5.3 21.66,53.66 22.25,54.25 22.25,57 23.25,58 25.75,58 | 24.5,58 24.5,58.75 23.5,59.75 20.25,59.75 | 20.25,59.75 20.25,59 | 20.25,59.75 20.25,60.5
N$9
  Top 0.508: U$5.5 14.88,57.87 13.75,59 11.43,59 RFBT.1 5.62,59.12 4.5,58 4.5,54.86 RFBB.2
N$10  (via drill 0.35)
  Top 0.508: U$5.1 22.12,51.12 v22.25,51 | CBOOT.1 13.63,49.63 v13.75,49.75
  Bottom 0.508: v13.75,49.75 21,49.75 v22.25,51
N$11
  Top 0.508: U$5.6 11.55,53.66 11.32,53.9 11.24,53.9 CCOMP2.1 10.4,57.56 RCOMP.2
N$12
  Top 0.508: CCOMP.1 7.5,56.79 RCOMP.1
N$15
  Top 0.508: IC1.4 53.97,36.52 U$12.2
N$16
  Top 0.406: IC1.6 57.78,41.44 57.95,41.27 58.82,41.27 U$14.1
  Top 0.508: U$14.1 60.27,35.9 U$13.2
N$18
  Top 0.508: IC1.5 56.47,36.18 U$9.1
PH
  Top 0.508: U$5.8 12.12,51.12 11.25,50.25 11.25,45.32
  pour Top (isolate 0.305, no thermals): 2.5,51.5 15.75,51.5 15.75,50.75 12.25,50.75 12.25,43.75 19.75,43.75 19.75,33.75 2.5,33.75
R1A
  Top 1.016: RIGHTMOTOR.1 4.06,22.35 5.05,22.35 15.47,11.92 15.47,11.88 U$2.1A
R1B
  Top 1.016: RIGHTMOTOR.2 4.06,19.81 5.93,19.81 11.43,14.31 11.43,13.38 U$2.1B
R2A  (via drill 0.35)
  Top 1.016: v10.75,20.5 18.29,12.96 U$2.2A
  Bottom 1.016: RIGHTMOTOR.3 4.06,19.15 4.72,19.15 6.07,20.5 v10.75,20.5
R2B
  Bottom 1.016: RIGHTMOTOR.4 5.59,13.2 18.95,13.2 20.55,11.6 U$2.2B
STEP1  (via drill 0.35)
  Top 0.2: U$2.STEP 10.47,24.47 11.5,25.5 v26.5,25.5 | v28.79,23.75 30.18,23.75 31.43,22.49 52.47,22.49 v52.75,22.21 | B1.4 78.75,43.75 v75,43.75 | v55,25.25 68.25,25.25 v68.5,25.5
  Bottom 0.2: v26.5,25.5 27.04,25.5 v28.79,23.75 | v52.75,22.21 52.75,23 v55,25.25 | v75,43.75 75,34.89 75.13,34.76 75.13,34.24 68.44,27.55 68.44,26.68 68.5,26.62 v68.5,25.5
STEP2  (via drill 0.35)
  Top 0.2: B1.5 80.7,44.95 78.5,42.75 v78.25,42.75
  Bottom 0.2: v78.25,42.75 78.25,30.56 81.14,27.66 81.14,26.11 82.5,24.75 82.5,14.5 82,14 75.79,14 U$1.STEP
SWITCH1
  Top 0.2: B1.14 69.25,31.71 69.25,34.79 69.4,34.94 72.48,34.94 73.75,36.21 73.75,37.25 73.55,37.45 73.55,37.63 73.41,37.78 72.29,37.78 70.94,39.13 S1.8 70.78,40.44 R8.1
SWITCH2
  Top 0.2: R7.1 71.16,36.98 S1.7 69.47,35.29 69.25,35.29 68.9,34.94 68.9,33.9 B1.15
SWITCH3
  Top 0.152: S1.6 72.49,34.05 R6.1
SWITCH4
  Top 0.2: R1.1 70.75,31.48 S1.5
SWITCH5
  Top 0.2: R9.1 S2.5
TRIG1  (via drill 0.35)
  Top 0.2: U$3.2 42.17,6.17 v42.5,6.5
  Top 0.305: U$3.2-2 U$3.2
  Bottom 0.2: v42.5,6.5 44.25,6.5 48.5,2.25 48.75,2.25 49,2 62.5,2 62.65,1.85 82.35,1.85 84.18,3.68 84.18,33.1 B1.9
TRIG2  (via drill 0.35)
  Top 0.2: U$4.2-2 v7.25,6
  Top 0.305: U$4.2 U$4.2-2
  Bottom 0.2: v7.25,6 7.25,3.25 9,1.5 82.5,1.5 84.53,3.53 84.53,47.99 B1.3
TRIG3  (via drill 0.35)  (1 unrouted)
  Top 0.2: U$6.2 82.71,8.46 83.25,9 83.25,25.12 v83.12,25.25
  Bottom 0.2: v83.12,25.25 83.12,26.11 83.68,26.68 83.68,28.52 B1.11
VIN
  Top 0.406: IC1.7 56.4,42.02 55.72,42.02 55.14,41.44 IC1.3
  pour Top (isolate 0.305, no thermals): 36,60.75 58.75,60.75 58.75,42 56,42 56,42.25 57.75,42.25 57.75,46.5 47,46.5 47,51.75 36,51.75
  pour Top (isolate 0.305, no thermals): 26.25,53 19.25,53 19.25,51.75 23.5,51.75 23.5,50.25 31,50.25 31,51.75 36.5,51.75 36.5,60.75 26.25,60.75
VO1  (via drill 0.35)
  Top 0.2: v54.5,17.25 v54.5,20.5
  Bottom 0.2: 54.5,7.72 J1.3 54.55,17.2 v54.5,17.25 | 54.57,23.93 54.55,23.91 | 54.57,23.93 55.63,24.99 55.63,25.63 58.5,28.5 61.75,28.5 64.25,31 64.25,34 64.5,34.25 64.5,47.28 B1.22 | v54.5,20.5 54.5,23.86 54.57,23.93
VO2  (via drill 0.35)
  Top 0.152: v73.5,43.75 73.5,40.75 75.75,38.5 75.75,31.14 v75.3,30.7
  Bottom 0.2: B1.23 67.25,51.72 68.44,50.52 68.44,48.81 v73.5,43.75 | v75.3,30.7 75.3,28.42 76.06,27.66 76.06,26.69 78.45,24.3 81.31,24.3 82.01,23.6 82.01,20.08 81.31,19.38 78.45,19.38 71.59,12.52 71.59,10.5 73.78,8.3 J2.3
VO3  (via drill 0.35)
  Top 0.2: J3.3 21.45,4.45 v35.25,18.25 | B1.16 65.75,33.29 65.75,30 65.25,29.5 65,29.5 62.38,26.88 v53.62,26.88
  Bottom 0.2: v35.25,18.25 35.5,18.25 36.5,17.25 43.75,17.25 51.25,24.75 51.5,24.75 v53.62,26.88 53.75,27
VO4  (via drill 0.35)
  Top 0.2: J4.3 32.77,13.78 v35.75,16.75 | v53,25.25 54.11,25.25 54.74,25.88 57.88,25.88 58,26 61.5,26 62,26.5 v63.5,26.5
  Bottom 0.2: v35.75,16.75 44,16.75 51.5,24.25 52,24.25 v53,25.25 | B1.17 67.25,36.48 66.06,35.28 66.06,29.06 v63.5,26.5

### Text on the board
tPlace: The / Jerrys | Ricardo Alcaraz / Jaap de Dood / Rosswell Tiongco